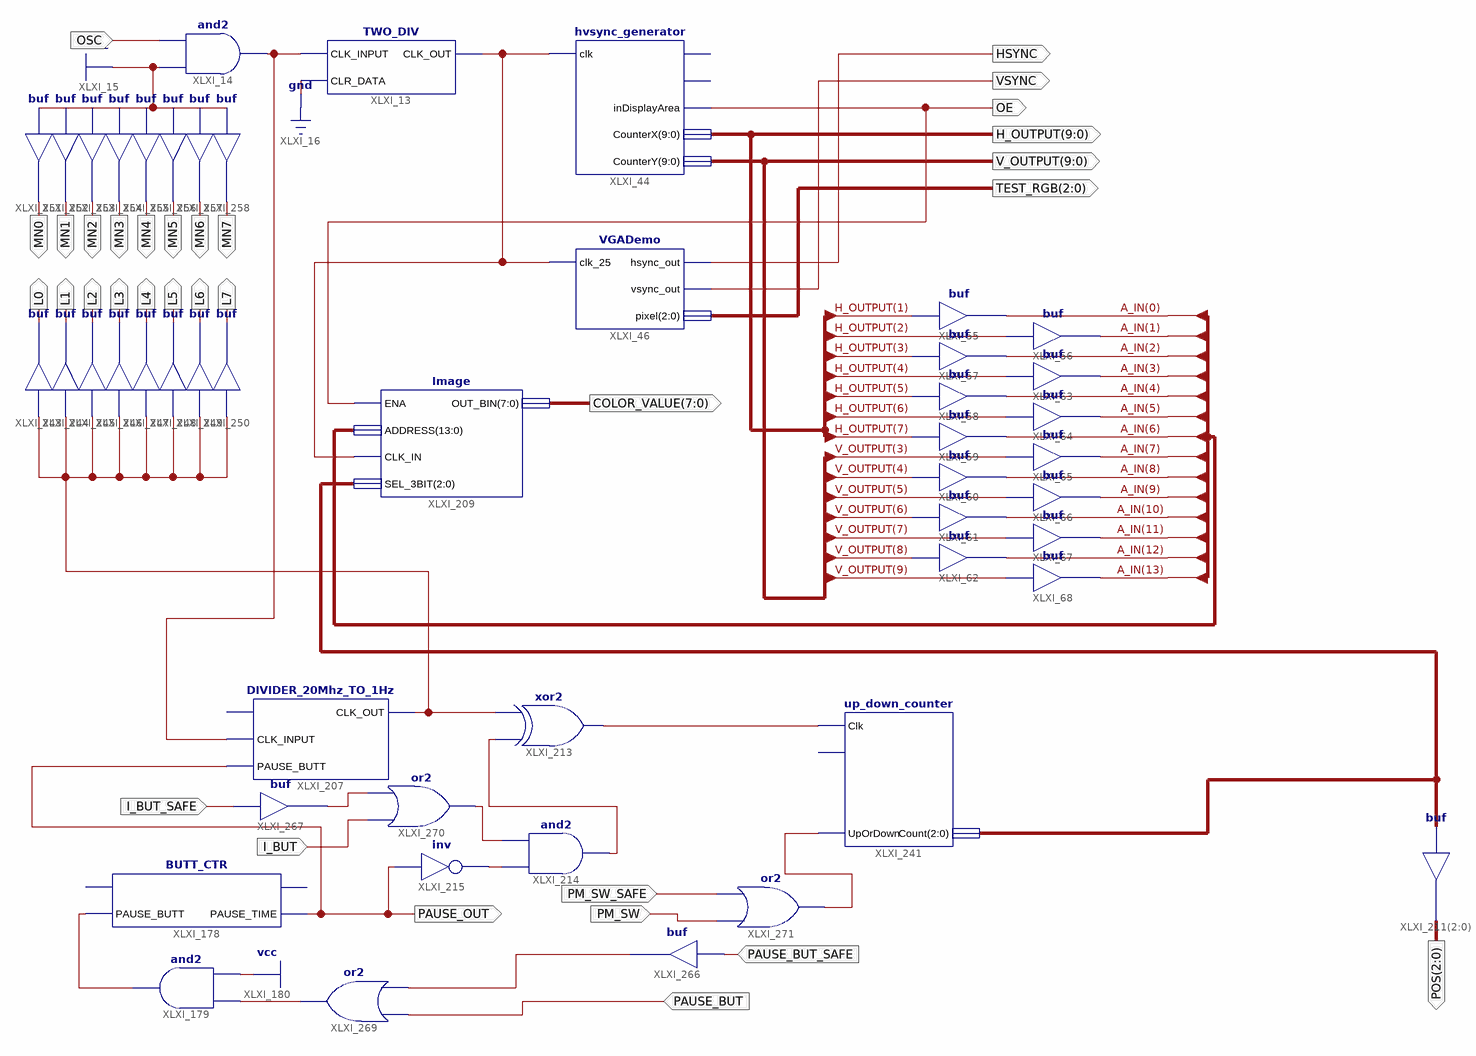
[diagram p0: schematic sheet 1]
// Xilinx ISE schematic TopLevel.sch (spartan6) as structural Verilog: 48 symbols, 32 ports
module TopLevel (
  input  OSC,
  input  PAUSE_BUT,
  input  PAUSE_BUT_SAFE,
  input  I_BUT_SAFE,
  input  PM_SW_SAFE,
  input  I_BUT,
  input  PM_SW,
  output [9:0] H_OUTPUT,
  output [2:0] TEST_RGB,
  output OE,
  output [9:0] V_OUTPUT,
  output VSYNC,
  output HSYNC,
  output [7:0] COLOR_VALUE,
  output PAUSE_OUT,
  output [2:0] POS,
  output L0,
  output L1,
  output L2,
  output L3,
  output L4,
  output L5,
  output L6,
  output L7,
  output MN0,
  output MN1,
  output MN2,
  output MN3,
  output MN4,
  output MN5,
  output MN6,
  output MN7
);

  wire dfcsdfs, XLXN_302, XLXN_370, XLXN_384, XLXN_401, XLXN_405, XLXN_476, XLXN_485, XLXN_486, XLXN_487,
       XLXN_491, XLXN_498;
  wire [2:0] Q;
  wire [13:0] A_IN;

  buf XLXI_55 (A_IN[0], H_OUTPUT[1]);
  buf XLXI_56 (A_IN[1], H_OUTPUT[2]);
  buf XLXI_57 (A_IN[2], H_OUTPUT[3]);
  buf XLXI_58 (A_IN[4], H_OUTPUT[5]);
  buf XLXI_59 (A_IN[6], H_OUTPUT[7]);
  buf XLXI_60 (A_IN[8], V_OUTPUT[4]);
  buf XLXI_61 (A_IN[10], V_OUTPUT[6]);
  buf XLXI_62 (A_IN[12], V_OUTPUT[8]);
  buf XLXI_63 (A_IN[3], H_OUTPUT[4]);
  buf XLXI_64 (A_IN[5], H_OUTPUT[6]);
  buf XLXI_65 (A_IN[7], V_OUTPUT[3]);
  buf XLXI_66 (A_IN[9], V_OUTPUT[5]);
  buf XLXI_67 (A_IN[11], V_OUTPUT[7]);
  buf XLXI_68 (A_IN[13], V_OUTPUT[9]);
  VGADemo XLXI_46 (.clk_25(XLXN_476), .hsync_out(HSYNC), .vsync_out(VSYNC), .pixel(TEST_RGB));
  hvsync_generator XLXI_44 (
    .clk(XLXN_476), .inDisplayArea(OE), .CounterX(H_OUTPUT), .CounterY(V_OUTPUT));  // open: vga_h_sync, vga_v_sync
  TWO_DIV XLXI_13 (.CLK_INPUT(XLXN_405), .CLR_DATA(1'b0), .CLK_OUT(XLXN_476));
  and XLXI_14 (XLXN_405, 1'b1, OSC);
  BUTT_CTR XLXI_178 (.PAUSE_BUTT(XLXN_302), .PAUSE_TIME(PAUSE_OUT));  // open: RESET_BUTT, RESET_TIME
  and XLXI_179 (XLXN_302, 1'b1, XLXN_485);
  DIVIDER_20Mhz_TO_1Hz XLXI_207 (.CLK_INPUT(XLXN_405), .PAUSE_BUTT(PAUSE_OUT), .CLK_OUT(dfcsdfs));  // open: CLR_DATA
  Image XLXI_209 (.ENA(OE), .ADDRESS(A_IN), .CLK_IN(XLXN_476), .SEL_3BIT(Q), .OUT_BIN(COLOR_VALUE));
  not XLXI_215 (XLXN_401, PAUSE_OUT);
  xor XLXI_213 (XLXN_384, XLXN_370, dfcsdfs);
  and XLXI_214 (XLXN_370, XLXN_401, XLXN_491);
  assign POS = Q;  // buf XLXI_211[2..0], 3 bits wide
  up_down_counter XLXI_241 (.Clk(XLXN_384), .UpOrDown(XLXN_498), .Count(Q));  // open: reset
  buf XLXI_243 (L0, dfcsdfs);
  buf XLXI_244 (L1, dfcsdfs);
  buf XLXI_245 (L2, dfcsdfs);
  buf XLXI_246 (L3, dfcsdfs);
  buf XLXI_247 (L4, dfcsdfs);
  buf XLXI_248 (L5, dfcsdfs);
  buf XLXI_249 (L6, dfcsdfs);
  buf XLXI_250 (L7, dfcsdfs);
  buf XLXI_251 (MN0, 1'b1);
  buf XLXI_252 (MN1, 1'b1);
  buf XLXI_253 (MN2, 1'b1);
  buf XLXI_254 (MN3, 1'b1);
  buf XLXI_255 (MN4, 1'b1);
  buf XLXI_256 (MN5, 1'b1);
  buf XLXI_257 (MN6, 1'b1);
  buf XLXI_258 (MN7, 1'b1);
  buf XLXI_266 (XLXN_486, PAUSE_BUT_SAFE);
  buf XLXI_267 (XLXN_487, I_BUT_SAFE);
  or XLXI_269 (XLXN_485, PAUSE_BUT, XLXN_486);
  or XLXI_270 (XLXN_491, XLXN_487, I_BUT);
  or XLXI_271 (XLXN_498, PM_SW_SAFE, PM_SW);
endmodule
